# Altium schematic sheet Main.SchDoc: Main Schematic
size A3; SPICEModelCacheWFTKRAJF: <root> / <DocumentId>WFTKRAJF</DocumentId> / <CacheFrame Number="0"> / <Model Name="mc34063" Kind="ckt"> / <Text>.SUBCKT mc34063 csw esw ct comm fb vcc ipk cdr / * csw = switch BJT collector, esw = switch BJT emitter ct = timing capacitor, comm = common / * fb = feedback control, vcc = power in, ipk = peak limiting, cdr = driver BJT collector / * pin numbers match order of inputs above. / * Voltage Sources / Vlogic vp5v comm DC 5V / * Reference and feedback comparator / * The reference is at 1.25V but decreases linearly to zero for Vcc &lt; 3.75V / Breference ref comm V=(V(vcc,comm)-1.25)*u(V(vcc,comm)-1.25)-(V(vcc,comm)-2.5)*u(V(vcc,comm)-3.75) / B1 1 comm V=u(V(ref,fb)) / R6 1 cinvcontrol 10K / C6 cinvcontrol comm 10pF / * Oscillator / * Hysteresis switch to drive current into timing capacitor / R1 vp5v osc 10k / S1 osc comm ct comm swmod / .MODEL swmod SW (SW VT = 1 VH = 0.25) / * Current source to drive charge/discharge currents for the timing capacitor / Bcurrent ct comm I=-35uA+255uA*u(2.5-V(osc,comm)) / * Current limiting circuit increases the charge rate of the timing capacitor / Qlimit ct ipk vcc limitQ / .model limitQ PNP(IS=1E-12 VAF=100 BF=200 IKF=0.1 XTB=1.5 BR=4 / +  CJC=4.5E-12 CJE=10E-12 RB=20 RC=0.1 RE=0.1 TR=250E-9 TF=350E-12 ITF=1 VTF=2 XTF=3) / * Differentiator to provide delays to overcome latch race conditions / Ctrigger osc delay  1pF / Rtrigger delay comm 100K / * Delay pulse squaring comparators plus Delay gating logic. / * inverse of positive delay transition anded with the oscillator to delay the start of / * the next high part. This is then nanded with the feedback gating signal. / Bsetgate set comm V=(1-(1-u(V(delay,comm)-1))*u(V(osc,comm)-2.5)*u(V(cinvcontrol,comm)-0.5)) / * Reset is just the negative delay transition anded with the oscillator and inverted. / Bminus reset comm V=(1-u(V(delay,comm)+1)*(1-u(V(osc,comm)-2.5))) / * SR Latch / Blatch1 4 comm V=(1-V(reset,comm)*u(V(3,comm)-0.5)) / R4 4 2 10K / C4 2 comm 1pF IC=1V / Blatch2 gate comm V=(1-V(set,comm)*u(V(2,comm)-0.5)) / R5 gate 3 10K / C5 3 comm 1pF / * Output switch gating and drive / Bcurrentdrive currentdrive comm I=10mA-20mA*V(gate,comm)*u(V(cinvcontrol,comm)-0.5) / Qdrive cdr currentdrive swbase driverQ / .model driverQ NPN(Bf=300 CJC=4pF CJE=8pF RB=20 RC=0.1 RE=0.1) / D2 comm currentdrive 1N914 / D1 currentdrive vcc 1N914 / .MODEL 1N914 D(Is=2.52n Rs=0.568 N=1.752 Cjo=4p M=.4 Tt=20n) / Rde swbase esw 100 / Qswitch csw swbase esw switchQ / .MODEL switchQ npn (BF=75 RB=10 RE=0.25 RC=0.25 CJE=10pF CJC=10pF) / .ends</Text> / </Model> / </CacheFrame> / </root>; ApprovedBy: LD Stanton; CheckedBy: JC Pead; Author: LD Stanton; CompanyName: University of Cape Town; DrawnBy: Lawrence Stanton; Engineer: Lawrence Stanton; Organization: University of Cape Town; Address1: Department of Electrical Engineering; Address2: Rondebosch; Address3: Cape Town; Address4: South Africa 7701; DocumentNumber: 1; Revision: v1.0; SheetNumber: 1; SheetTotal: 1; Approv_Date_Eng: --/--/----; Approv_Date_Chk: --/--/----; PCB_Doc: PCB.PcbDoc; ASM_Doc: TBD; FAB_Doc: TBD; CML_Doc: TBD; BOM_Doc: TBD; Project_Name: USB Split Rail Power Supply
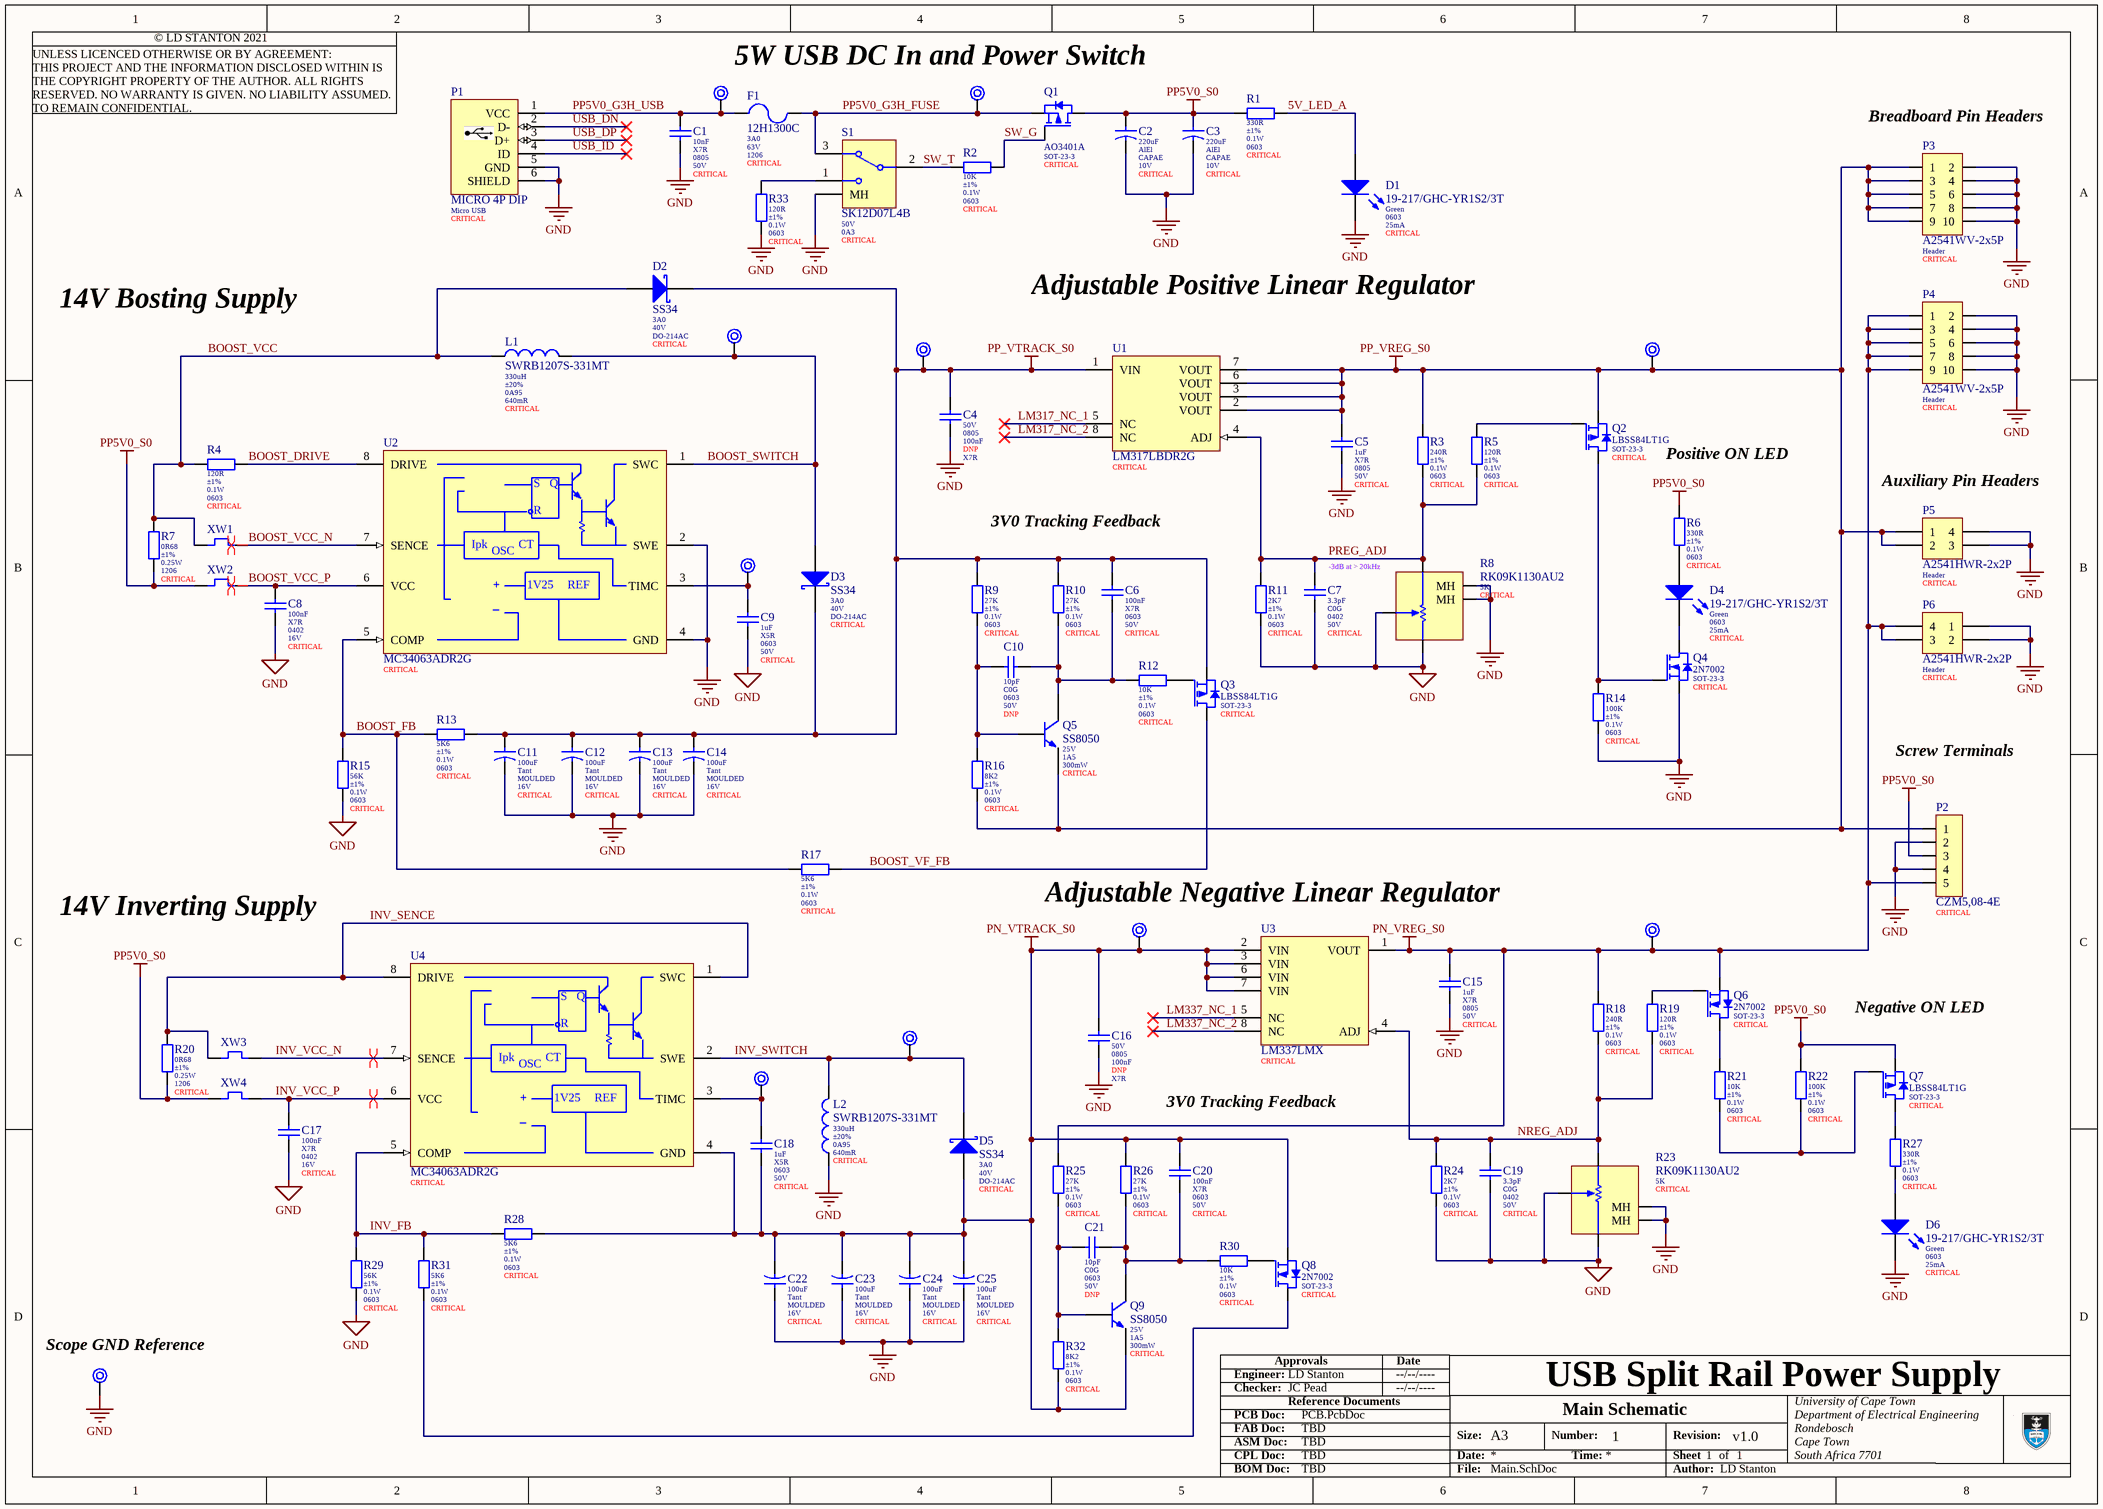
[diagram p0: Main.SchDoc]

## Parts
C1  value 10nF  Dielectric: X7R  Package: 0805  Voltage: 50V  Populate: CRITICAL  [0605_065_A_N]  (hidden comment: CL21B103KBANNNC)
C2  value 220uF  Dielectric: AlEl  Package: CAPAE  Voltage: 10V  Populate: CRITICAL  [CAPAE 6354]  (hidden comment: RVT1A221M0605)
C3  value 220uF  Dielectric: AlEl  Package: CAPAE  Voltage: 10V  Populate: CRITICAL  [CAPAE 6354]  (hidden comment: RVT1A221M0605)
C4  value 100nF  Voltage: 50V  Populate: DNP  Dielectric: X7R  [0805]  (hidden comment: CC0805KRX7R9BB104)
C5  value 1uF  Dielectric: X7R  Package: 0805  Voltage: 50V  Populate: CRITICAL  [0805_125_F_N]  (hidden comment: CL21B105KBFNNNE)
C6  value 100nF  Dielectric: X7R  Voltage: 50V  Populate: CRITICAL  [0603]  (hidden comment: CC0603KRX7R9BB104)
C7  value 3.3pF  Dielectric: C0G  Package: 0402  Voltage: 50V  Populate: CRITICAL  [0402_050]  (hidden comment: 0402CG3R3C500NT)
C8  value 100nF  Dielectric: X7R  Package: 0402  Voltage: 16V  Populate: CRITICAL  [0402_050_5_N]  (hidden comment: CL05B104KO5NNNC)
C9  value 1uF  Dielectric: X5R  Package: 0603  Voltage: 50V  Populate: CRITICAL  [0603_080_8_N]  (hidden comment: CL10A105KB8NNNC)
C10  value 10pF  Dielectric: C0G  Package: 0603  Voltage: 50V  Populate: DNP  [0603_080_8_N]  (hidden comment: CL10C100JB8NNNC)
C11  value 100uF  Dielectric: Tant  Package: MOULDED  Voltage: 16V  Populate: CRITICAL  [Case D]  (hidden comment: 293D107X9016D2TE3)
C12  value 100uF  Dielectric: Tant  Package: MOULDED  Voltage: 16V  Populate: CRITICAL  [Case D]  (hidden comment: 293D107X9016D2TE3)
C13  value 100uF  Dielectric: Tant  Package: MOULDED  Voltage: 16V  Populate: CRITICAL  [Case D]  (hidden comment: 293D107X9016D2TE3)
C14  value 100uF  Dielectric: Tant  Package: MOULDED  Voltage: 16V  Populate: CRITICAL  [Case D]  (hidden comment: 293D107X9016D2TE3)
C15  value 1uF  Dielectric: X7R  Package: 0805  Voltage: 50V  Populate: CRITICAL  [0805_125_F_N]  (hidden comment: CL21B105KBFNNNE)
C16  value 100nF  Voltage: 50V  Populate: DNP  Dielectric: X7R  [0805]  (hidden comment: CC0805KRX7R9BB104)
C17  value 100nF  Dielectric: X7R  Package: 0402  Voltage: 16V  Populate: CRITICAL  [0402_050_5_N]  (hidden comment: CL05B104KO5NNNC)
C18  value 1uF  Dielectric: X5R  Package: 0603  Voltage: 50V  Populate: CRITICAL  [0603_080_8_N]  (hidden comment: CL10A105KB8NNNC)
C19  value 3.3pF  Dielectric: C0G  Package: 0402  Voltage: 50V  Populate: CRITICAL  [0402_050]  (hidden comment: 0402CG3R3C500NT)
C20  value 100nF  Dielectric: X7R  Voltage: 50V  Populate: CRITICAL  [0603]  (hidden comment: CC0603KRX7R9BB104)
C21  value 10pF  Dielectric: C0G  Package: 0603  Voltage: 50V  Populate: DNP  [0603_080_8_N]  (hidden comment: CL10C100JB8NNNC)
C22  value 100uF  Dielectric: Tant  Package: MOULDED  Voltage: 16V  Populate: CRITICAL  [Case D]  (hidden comment: 293D107X9016D2TE3)
C23  value 100uF  Dielectric: Tant  Package: MOULDED  Voltage: 16V  Populate: CRITICAL  [Case D]  (hidden comment: 293D107X9016D2TE3)
C24  value 100uF  Dielectric: Tant  Package: MOULDED  Voltage: 16V  Populate: CRITICAL  [Case D]  (hidden comment: 293D107X9016D2TE3)
C25  value 100uF  Dielectric: Tant  Package: MOULDED  Voltage: 16V  Populate: CRITICAL  [Case D]  (hidden comment: 293D107X9016D2TE3)
D1  19-217/GHC-YR1S2/3T  Colour: Green  Package: 0603  Current: 25mA  Placement: CRITICAL  [LED 0603]
D2  SS34  DC Forward Curent: 3A0  DC Reverse Blocking: 40V  Placement: CRITICAL  [DO-214AC]
D3  SS34  DC Forward Curent: 3A0  DC Reverse Blocking: 40V  Placement: CRITICAL  [DO-214AC]
D4  19-217/GHC-YR1S2/3T  Colour: Green  Package: 0603  Current: 25mA  Placement: CRITICAL  [LED 0603]
D5  SS34  DC Forward Curent: 3A0  DC Reverse Blocking: 40V  Placement: CRITICAL  [DO-214AC]
D6  19-217/GHC-YR1S2/3T  Colour: Green  Package: 0603  Current: 25mA  Placement: CRITICAL  [LED 0603]
F1  12H1300C  Current: 3A0  Voltage: 63V  Package: 1206  Placement: CRITICAL  [1206_060]
L1  SWRB1207S-331MT  value 330uH  Tolerance: ±20%  Rated Current: 0A95  DC Resistance: 640mR  Populate: CRITICAL  [SWRB1207S]
L2  SWRB1207S-331MT  value 330uH  Tolerance: ±20%  Rated Current: 0A95  DC Resistance: 640mR  Populate: CRITICAL  [SWRB1207S]
P1  MICRO 4P DIP  USB Connector Type: Micro USB  Placement: CRITICAL  [MICRO 4P DIP]
P2  CZM5,08-4E  Placement: CRITICAL  [Screw Down 5]
P3  A2541WV-2x5P  Type: Header  Placement: CRITICAL  [Pin Header 10 2 Vertical Male]
P4  A2541WV-2x5P  Type: Header  Placement: CRITICAL  [Pin Header 10 2 Vertical Male]
P5  A2541HWR-2x2P  Type: Header  Placement: CRITICAL  [Pin Header 4 2 Right Female]
P6  A2541HWR-2x2P  Type: Header  Placement: CRITICAL  [Pin Header 4 2 Right Female]
Q1  AO3401A  Package: SOT-23-3  Placement: CRITICAL  [SOT-23-3 (2N7002)]
Q2  LBSS84LT1G  Package: SOT-23-3  Placement: CRITICAL  [SOT-23-3 (2N7002)]
Q3  LBSS84LT1G  Package: SOT-23-3  Placement: CRITICAL  [SOT-23-3 (2N7002)]
Q4  2N7002  Package: SOT-23-3  Placement: CRITICAL  [SOT-23-3 (2N7002)]
Q5  SS8050  VCE: 25V  Collector Current: 1A5  Power: 300mW  Placement: CRITICAL  [SOT-23-3 Generic]
Q6  2N7002  Package: SOT-23-3  Placement: CRITICAL  [SOT-23-3 (2N7002)]
Q7  LBSS84LT1G  Package: SOT-23-3  Placement: CRITICAL  [SOT-23-3 (2N7002)]
Q8  2N7002  Package: SOT-23-3  Placement: CRITICAL  [SOT-23-3 (2N7002)]
Q9  SS8050  VCE: 25V  Collector Current: 1A5  Power: 300mW  Placement: CRITICAL  [SOT-23-3 Generic]
R1  value 330R  Tolerance: ±1%  Power: 0.1W  Populate: CRITICAL  [0603]  (hidden comment: 0603WAF3300T5E)
R2  value 10K  Tolerance: ±1%  Power: 0.1W  Populate: CRITICAL  [0603]  (hidden comment: 0603WAF1002T5E)
R3  value 240R  Tolerance: ±1%  Power: 0.1W  Populate: CRITICAL  [0603]  (hidden comment: 0603WAF2400T5E)
R4  value 120R  Tolerance: ±1%  Power: 0.1W  Populate: CRITICAL  [0603]  (hidden comment: 0603WAF1200T5E)
R5  value 120R  Tolerance: ±1%  Power: 0.1W  Populate: CRITICAL  [0603]  (hidden comment: 0603WAF1200T5E)
R6  value 330R  Tolerance: ±1%  Power: 0.1W  Populate: CRITICAL  [0603]  (hidden comment: 0603WAF3300T5E)
R7  value 0R68  Tolerance: ±1%  Power: 0.25W  Populate: CRITICAL  [1206]  (hidden comment: 1206W4F680LT5E)
R8  RK09K1130AU2  Resistance: 5K  Placement: CRITICAL  [RK09K113]
R9  value 27K  Tolerance: ±1%  Power: 0.1W  Populate: CRITICAL  [0603]  (hidden comment: 0603WAF2702T5E)
R10  value 27K  Tolerance: ±1%  Power: 0.1W  Populate: CRITICAL  [0603]  (hidden comment: 0603WAF2702T5E)
R11  value 2K7  Tolerance: ±1%  Power: 0.1W  Populate: CRITICAL  [0603]  (hidden comment: 0603WAF2701T5E)
R12  value 10K  Tolerance: ±1%  Power: 0.1W  Populate: CRITICAL  [0603]  (hidden comment: 0603WAF1002T5E)
R13  value 5K6  Tolerance: ±1%  Power: 0.1W  Populate: CRITICAL  [0603]  (hidden comment: 0603WAF5601T5E)
R14  value 100K  Tolerance: ±1%  Power: 0.1W  Populate: CRITICAL  [0603]  (hidden comment: 0603WAF1003T5E)
R15  value 56K  Tolerance: ±1%  Power: 0.1W  Populate: CRITICAL  [0603]  (hidden comment: 0603WAF5602T5E)
R16  value 8K2  Tolerance: ±1%  Power: 0.1W  Populate: CRITICAL  [0603]  (hidden comment: 0603WAF8201T5E)
R17  value 5K6  Tolerance: ±1%  Power: 0.1W  Populate: CRITICAL  [0603]  (hidden comment: 0603WAF5601T5E)
R18  value 240R  Tolerance: ±1%  Power: 0.1W  Populate: CRITICAL  [0603]  (hidden comment: 0603WAF2400T5E)
R19  value 120R  Tolerance: ±1%  Power: 0.1W  Populate: CRITICAL  [0603]  (hidden comment: 0603WAF1200T5E)
R20  value 0R68  Tolerance: ±1%  Power: 0.25W  Populate: CRITICAL  [1206]  (hidden comment: 1206W4F680LT5E)
R21  value 10K  Tolerance: ±1%  Power: 0.1W  Populate: CRITICAL  [0603]  (hidden comment: 0603WAF1002T5E)
R22  value 100K  Tolerance: ±1%  Power: 0.1W  Populate: CRITICAL  [0603]  (hidden comment: 0603WAF1003T5E)
R23  RK09K1130AU2  Resistance: 5K  Placement: CRITICAL  [RK09K113]
R24  value 2K7  Tolerance: ±1%  Power: 0.1W  Populate: CRITICAL  [0603]  (hidden comment: 0603WAF2701T5E)
R25  value 27K  Tolerance: ±1%  Power: 0.1W  Populate: CRITICAL  [0603]  (hidden comment: 0603WAF2702T5E)
R26  value 27K  Tolerance: ±1%  Power: 0.1W  Populate: CRITICAL  [0603]  (hidden comment: 0603WAF2702T5E)
R27  value 330R  Tolerance: ±1%  Power: 0.1W  Populate: CRITICAL  [0603]  (hidden comment: 0603WAF3300T5E)
R28  value 5K6  Tolerance: ±1%  Power: 0.1W  Populate: CRITICAL  [0603]  (hidden comment: 0603WAF5601T5E)
R29  value 56K  Tolerance: ±1%  Power: 0.1W  Populate: CRITICAL  [0603]  (hidden comment: 0603WAF5602T5E)
R30  value 10K  Tolerance: ±1%  Power: 0.1W  Populate: CRITICAL  [0603]  (hidden comment: 0603WAF1002T5E)
R31  value 5K6  Tolerance: ±1%  Power: 0.1W  Populate: CRITICAL  [0603]  (hidden comment: 0603WAF5601T5E)
R32  value 8K2  Tolerance: ±1%  Power: 0.1W  Populate: CRITICAL  [0603]  (hidden comment: 0603WAF8201T5E)
R33  value 120R  Tolerance: ±1%  Power: 0.1W  Populate: CRITICAL  [0603]  (hidden comment: 0603WAF1200T5E)
S1  SK12D07L4B  Voltage: 50V  Current: 0A3  Placement: CRITICAL  [SK12D07L4B]
TP1  Test Point  [Test Point 0.6]  (value not drawn)  (no BOM)
TP2  Test Point  [Test Point 0.6]  (value not drawn)  (no BOM)
TP3  Test Point  [Test Point 0.6]  (value not drawn)  (no BOM)
TP4  Test Point  [Test Point 0.6]  (value not drawn)  (no BOM)
TP5  Test Point  [Test Point 0.6]  (value not drawn)  (no BOM)
TP6  Test Point  [Test Point 0.6]  (value not drawn)  (no BOM)
TP7  Test Point  [Test Point 0.6]  (value not drawn)  (no BOM)
TP8  Test Point  [Test Point 0.6]  (value not drawn)  (no BOM)
TP9  Test Point  [Test Point 0.6]  (value not drawn)  (no BOM)
TP10  Test Point  [Test Point 0.6]  (value not drawn)  (no BOM)
TP11  Test Point  [Test Point 0.8 TH]  (value not drawn)  (no BOM)
U1  LM317LBDR2G  Placement: CRITICAL  [SOIC-8 NB]
U2  MC34063ADR2G  Placement: CRITICAL  [SOIC-8 NB]
U3  LM337LMX  Placement: CRITICAL  [SOIC-8 D (R-PDSO-G8)]
U4  MC34063ADR2G  Placement: CRITICAL  [SOIC-8 NB]
XW1  Short 2 Nets  [Short 0.5mm 2 Net]  (value not drawn)  (net tie, no BOM)
XW2  Short 2 Nets  [Short 0.5mm 2 Net]  (value not drawn)  (net tie, no BOM)
XW3  Short 2 Nets  [Short 0.5mm 2 Net]  (value not drawn)  (net tie, no BOM)
XW4  Short 2 Nets  [Short 0.5mm 2 Net]  (value not drawn)  (net tie, no BOM)

## Nets
GND: C1.2 C2.2 C3.2 C4.2 C5.2 C7.2 C8.2 C9.2 C11.2 C12.2 C13.2 C14.2 C15.2 C16.2 C17.2 C19.2 C22.1 C23.1 C24.1 C25.1 D1.K D6.K L2.1 P1.5(GND) P1.6(SHIELD) P2.2 P2.4 P3.2 P3.4 P3.6 P3.8 P3.10 P4.2 P4.4 P4.6 P4.8 P4.10 P5.3 P5.4 P6.1 P6.2 Q4.2(S) R8.1 R8.2 R8.4(MH) R8.5(MH) R11.2 R14.1 R15.2 R23.2 R23.3 R23.4(MH) R23.5(MH) R24.2 R29.2 R33.1 S1.EH(MH) TP11.1 U2.2(SWE) U2.4(GND)
PN_VREG_S0: C15.1 P2.5 P4.1 P4.3 P4.5 P4.7 P4.9 P6.3 P6.4 Q6.2(S) R18.1 R25.1 TP8.1 U3.1(VOUT)
PN_VTRACK_S0: C16.1 C18.2 C20.1 C22.2 C23.2 C24.2 C25.2 D5.2(A) Q8.2(S) Q9.2(E) R26.1 R28.2 R32.2 TP7.1 U3.2(VIN) U3.3(VIN) U3.6(VIN) U3.7(VIN) U4.4(GND)
PP5V0_S0: C2.1 C3.1 P2.3 Q1.3(D) Q7.2(S) R1.1 R6.2 R7.2 R20.2 R22.2 XW2.2 XW4.2
PP_VREG_S0: C5.1 P2.1 P3.1 P3.3 P3.5 P3.7 P3.9 P5.1 P5.2 Q2.2(S) Q5.2(E) R3.1 R16.2 TP5.1 U1.2(VOUT) U1.3(VOUT) U1.6(VOUT) U1.7(VOUT)
PP_VTRACK_S0: C4.1 C6.1 C11.1 C12.1 C13.1 C14.1 D2.1(K) D3.1(K) Q3.2(S) R9.1 R10.1 R13.2 TP4.1 U1.1(VIN)
5V_LED_A: D1.A R1.2
BOOST_DRIVE: R4.2 U2.8(DRIVE)
BOOST_FB: R13.1 R15.1 R17.1 U2.5(COMP)
BOOST_SWITCH: D3.2(A) L1.2 TP3.1 U2.1(SWC)
BOOST_VCC: D2.2(A) L1.1 R4.1 R7.1 XW1.2
BOOST_VCC_N: U2.7(SENCE) XW1.1
BOOST_VCC_P: C8.1 U2.6(VCC) XW2.1
BOOST_VF_FB: Q3.3(D) R17.2
INV_FB: R28.1 R29.1 R31.2 U4.5(COMP)
INV_SENCE: R20.1 U4.1(SWC) U4.8(DRIVE) XW3.2
INV_SWITCH: D5.1(K) L2.2 TP9.1 U4.2(SWE)
INV_VCC_N: U4.7(SENCE) XW3.1
INV_VCC_P: C17.1 U4.6(VCC) XW4.1
LM317_NC_1: U1.5(NC)
LM317_NC_2: U1.8(NC)
LM337_NC_1: U3.5(NC)
LM337_NC_2: U3.8(NC)
NREG_ADJ: C19.1 R18.2 R19.1 R23.1 R24.1 U3.4(ADJ)
PP5V0_G3H_FUSE: F1.2 Q1.2(S) S1.3 TP2.1
PP5V0_G3H_USB: C1.1 F1.1 P1.1(VCC) TP1.1
PREG_ADJ: C7.1 R3.2 R5.1 R8.3 R11.1 U1.4(ADJ)
SW_G: Q1.1(G) R2.2
SW_T: R2.1 S1.2
USB_DN: P1.2(D-)
USB_DP: P1.3(D+)
USB_ID: P1.4(ID)
NetC6_2: C6.2 C10.2 Q5.3(C) R10.2 R12.1
NetC9_1: C9.1 TP6.1 U2.3(TIMC)
NetC10_1: C10.1 Q5.1(B) R9.2 R16.1
NetC18_1: C18.1 TP10.1 U4.3(TIMC)
NetC20_2: C20.2 C21.2 Q9.3(C) R26.2 R30.1
NetC21_1: C21.1 Q9.1(B) R25.2 R32.1
NetD4_A: D4.A R6.1
NetD4_K: D4.K Q4.3(D)
NetD6_A: D6.A R27.2
NetQ2_1: Q2.1(G) R5.2
NetQ2_3: Q2.3(D) Q4.1(G) R14.2
NetQ3_1: Q3.1(G) R12.2
NetQ6_1: Q6.1(G) R19.2
NetQ6_3: Q6.3(D) R21.1
NetQ7_1: Q7.1(G) R21.2 R22.1
NetQ7_3: Q7.3(D) R27.1
NetQ8_1: Q8.1(G) R30.2
NetQ8_3: Q8.3(D) R31.1
NetR33_2: R33.2 S1.1

## Layout directives
differential pair: BOOST_VCC_N, BOOST_VCC_P, INV_VCC_N, INV_VCC_P

## Notes on the sheet
- 5W USB DC In and Power Switch
- (near P3) Breadboard Pin Headers
- 14V Bosting Supply
- Adjustable Positive Linear Regulator
- Positive ON LED
- (near P5) Auxiliary Pin Headers
- 3V0 Tracking Feedback
- -3dB at > 20kHz
- Screw Terminals
- 14V Inverting Supply
- Adjustable Negative Linear Regulator
- Negative ON LED
- (near TP11) Scope GND Reference
- © LD STANTON 2021
- UNLESS LICENCED OTHERWISE OR BY AGREEMENT:
  THIS PROJECT AND THE INFORMATION DISCLOSED WITHIN IS THE COPYRIGHT PROPERTY OF THE AUTHOR. ALL RIGHTS RESERVED. NO WARRANTY IS GIVEN. NO LIABILITY ASSUMED. TO REMAIN CONFIDENTIAL.
- Engineer:
- Checker:
- Approvals
- Date
- PCB Doc:
- ASM Doc:
- FAB Doc:
- CPL Doc:
- Reference Documents
- Size:
- Date:
- A3
- Number:
- Time:
- Revision:
- Sheet
- of
- BOM Doc:
- File:
- Author:
- (in symbol MC34063ADR2G) S; Q; R; Ipk; CT; OSC; +; 1V25; REF; _

## Library data of the parts
C1 = MLCC 10nF 0805 50V X7R: MLCC 10nF 0805 50V X7R ±10%; Tolerance: ±10%; LCSC Part Number: C1710; ComponentLink1Description: Datasheet; ComponentLink1URL: https://datasheet.lcsc.com/szlcsc/Samsung-Electro-Mechanics-CL05C100JB5NNNC_C32949.pdf; Supplier 1: Digi-Key; Supplier Part Number 1: 1276-1015-1-ND
C2 C3 = Cap AlEl 220uF 10V: Aluminium Electrolytic Capacitor 220uF CAPAE 10V ±20%; Manufacturer: Honor Elec; Tolerance: ±20%; LCSC Part Number: C3345; ComponentLink1Description: Datasheet; ComponentLink1URL: https://datasheet.lcsc.com/szlcsc/Samsung-Electro-Mechanics-CL05C100JB5NNNC_C32949.pdf
C4 C16 = MLCC 100nF 50V 0805 X7R: MLCC 100nF 50V 0805 X7R ±10%; Tolerance: ±10%; LCSC Part Number: C49678; ComponentLink1Description: Datasheet; ComponentLink1URL: https://datasheet.lcsc.com/szlcsc/YAGEO-CC0603KRX7R9BB104_C14663.pdf; Package: 0805
C5 C15 = MLCC 1uF 0805 50V X7R: MLCC 1uF 0805 50V X7R ±10%; Tolerance: ±10%; LCSC Part Number: C15849; ComponentLink1Description: Datasheet; ComponentLink1URL: https://datasheet.lcsc.com/szlcsc/Samsung-Electro-Mechanics-CL05C100JB5NNNC_C32949.pdf; Supplier 1: Digi-Key; Supplier 2: Digi-Key; Supplier Part Number 2: 1276-1026-1-ND; Supplier Part Number 1: 1276-1029-1-ND
C6 C20 = MLCC 100nF 50V 0603 X7R: MLCC 100nF 50V 0603 X7R ±10%; Tolerance: ±10%; LCSC Part Number: C14663; ComponentLink1Description: Datasheet; ComponentLink1URL: https://datasheet.lcsc.com/szlcsc/YAGEO-CC0603KRX7R9BB104_C14663.pdf; Supplier 1: Digi-Key; Supplier Part Number 1: 311-1344-6-ND; Package: 0603
C7 C19 = MLCC 3.3pF 0402 50V C0G: MLCC 3.3pF 0402 50V C0G ±0.25pF; Tolerance: ±0.25pF; LCSC Part Number: C1565; ComponentLink1Description: Datasheet; ComponentLink1URL: https://datasheet.lcsc.com/szlcsc/Guangdong-Fenghua-Advanced-Tech-0402B102K500NT_C1523.pdf
C8 C17 = MLCC 100nF 0402 16V X7R: MLCC 100nF 0402 16V X7R ±10%; Tolerance: ±10%; LCSC Part Number: C1525; ComponentLink1Description: Datasheet; ComponentLink1URL: https://datasheet.lcsc.com/szlcsc/Samsung-Electro-Mechanics-CL05C100JB5NNNC_C32949.pdf
C9 C18 = MLCC 1uF 0603 50V X5R: MLCC 1uF 0603 50V X5R ±10%; Tolerance: ±10%; LCSC Part Number: C15849; ComponentLink1Description: Datasheet; ComponentLink1URL: https://datasheet.lcsc.com/szlcsc/Samsung-Electro-Mechanics-CL05C100JB5NNNC_C32949.pdf; Supplier 1: Digi-Key; Supplier Part Number 1: 1276-1860-1-ND
C10 C21 = MLCC 10pF 0603 50V C0G: MLCC 10pF 0603 C0G ±0.1pF; Tolerance: ±0.1pF; LCSC Part Number: C1634; ComponentLink1Description: Datasheet; ComponentLink1URL: https://datasheet.lcsc.com/szlcsc/Samsung-Electro-Mechanics-CL05C100JB5NNNC_C32949.pdf; Supplier 1: Digi-Key; Supplier Part Number 1: 1276-1027-1-ND
C11-C14 C22-C25 = Cap Tant 100uF 16V: Tantalum Capacitor 100uF 16V ±20%; Manufacturer: Vishay; Tolerance: ±20%; LCSC Part Number: C129696; ComponentLink1Description: Datasheet; ComponentLink1URL: https://datasheet.lcsc.com/szlcsc/Vishay-Intertech-293D107X9016D2TE3_C129696.pdf
D1 D4 D6 = LED 0603 Green: LED 0603 SMT Green; Nominal Forward Voltage: 3V3; LCSC Part Number: C72043; Supplier 1: Mouser; Supplier Part Number 1: 638-19217GHCYR1S23T; ComponentLink1Description: Datasheet; ComponentLink1URL: https://datasheet.lcsc.com/szlcsc/Everlight-Elec-19-217-GHC-YR1S2-3T_C72043.pdf
D2 D3 D5 = SS34: Schottky Barrier Diode 40V 3A0 550mV; Manufacturer: MDD; LCSC Part Number: C8678; ComponentLink1Description: Datasheet; ComponentLink1URL: https://datasheet.lcsc.com/szlcsc/1903051003_MDD-Jiangsu-Yutai-Elec-SS34_C8678.pdf; Package: DO-214AC
F1 = Fuse 3A Slow 1206: Fuse SMD Slow Blow 3A 63VAC 1206; ComponentLink1Description: Datasheet; Type: Slow Blow; LCSC Part Number: C182445
L1 L2 = Inductor 330uH ±20% 0A95: Inductor 330uH ±20% 0A95 640mR Moulded SMD 12.5x12.5x8.0mm; Manufacturer: Sunlord; ComponentLink1Description: Datasheet; ComponentLink1URL: https://datasheet.lcsc.com/szlcsc/1912111437_Sunlord-MWSA0603S-220MT_C408453.pdf; Saturation Current: 0A95; LCSC Part Number: C169381
P1 = MICRO 4P DIP: Micro USB Connector SMT with TH Mounts; LCSC Part Number: C456008
P2 = Screw Down 5 Way 5.08mm: Screw Down Terminal 5 Way 5.08mm Pitch
P3 P4 = Pin Header 10 2 Male Vertical: Pin Header 10 Way Double Row Vertical Angle; ComponentLink1Description: Datasheet; ComponentLink1URL: https://datasheet.lcsc.com/szlcsc/2010160505_CJT-Changjiang-Connectors-A2541WV-2x5P_C225520.pdf; LCSC Part Number: C225520
P5 P6 = Pin Header 4 2 Female Right: Pin Header 4 Way Double Row Female Right Angle
Q1 = AO3401A: MOSFET Trench 4A0 30V 85mR ±12V P-Channel Enhancement AOS SOT-22-3L; VGS(th) Max: -1v3; Power: 0.9W; Id Max: 3A2; VDS Max: -30V; ComponentLink2URL: https://datasheet.lcsc.com/szlcsc/Alpha-Omega-Semicon-AOS-AO3401A_C15127.pdf; VGS Max: ±12V; ComponentLink2Description: Datasheet; Rds Max: 85mR; LCSC Part Number: C20917
Q2 Q3 Q7 = LBSS84LT1G: Small Signal MOSFET, 130 mA, 50 V, P-Channel, Enhancement, LRC SOT-23-3; Ciss Typ: 30pF; VGS(th) Max: 2V0; Crss Typ: 5pF; VGS Max: ±20V; Power: 0.225W; Coss Typ: 10pF; Id Max: 0.13A; Rds Max: 10R; VDS Max: -50V; ComponentLink2URL: https://datasheet.lcsc.com/szlcsc/Leshan-Radio-LBSS84LT1G_C8492.pdf; ComponentLink2Description: Datasheet; LCSC Part Number: C8492
Q4 Q6 Q8 = 2N7002: Small Signal MOSFET, 500 mA, 60 V, N-Channel, Enhancement, JCET SOT-23-3; Ciss Typ: 50pF; VGS(th) Max: 2V5; Crss Typ: 5pF; VGS Max: ±20V; Power: 0.225W; Coss Typ: 25pF; Id Max: 0.2A; Rds Max: 7R; ComponentLink2URL: https://datasheet.lcsc.com/szlcsc/Changjiang-Electronics-Tech-CJ-2N7002_C8545.pdf; ComponentLink2Description: Datasheet; LCSC Part Number: C8545
Q5 Q9 = SS8050: BJT NPN 1A5 25V SOT-23-3; Manufacturer: Changjiang Electronics; DC Gain: 120-400; VCE(sat): 0V5; LCSC Part Number: C2150; ComponentLink1Description: Datasheet; ComponentLink1URL: https://datasheet.lcsc.com/szlcsc/Changjiang-Electronics-Tech-CJ-SS8050_C2150.pdf
R1 R6 R27 = Res 330R 0603: Lead Free Thick Film Chip Resistor 0805 ±1%; ComponentLink1Description: Datasheet; ComponentLink1URL: https://datasheet.lcsc.com/szlcsc/1811062009_UNI-ROYAL-Uniroyal-Elec-0603WAF1002T5E_C25804.pdf; Temperature: -55 ~ 155°C; LCSC Part Number: C23138; Package: 0603
R2 R12 R21 R30 = Res 10K 0603: Lead Free Thick Film Chip Resistor 0603 ±1%; ComponentLink1Description: Datasheet; ComponentLink1URL: https://datasheet.lcsc.com/szlcsc/1811062009_UNI-ROYAL-Uniroyal-Elec-0603WAF1002T5E_C25804.pdf; Temperature: -55 ~ 155°C; LCSC Part Number: C25804; Package: 0603
R3 R18 = Res 240R 0603: Lead Free Thick Film Chip Resistor 0603 ±1%; ComponentLink1Description: Datasheet; ComponentLink1URL: https://datasheet.lcsc.com/szlcsc/1811062009_UNI-ROYAL-Uniroyal-Elec-0603WAF1002T5E_C25804.pdf; Temperature: -55 ~ 155°C; LCSC Part Number: C23350; Package: 0603
R4 R5 R19 R33 = Res 120R 0603: Lead Free Thick Film Chip Resistor 0603 ±1%; ComponentLink1Description: Datasheet; ComponentLink1URL: https://datasheet.lcsc.com/szlcsc/1811062009_UNI-ROYAL-Uniroyal-Elec-0603WAF1002T5E_C25804.pdf; Temperature: -55 ~ 155°C; LCSC Part Number: C22787; Package: 0603
R7 R20 = Res 0R68 1206: Lead Free Thick Film Chip Resistor 1206 ±1%; ComponentLink1Description: Datasheet; ComponentLink1URL: https://datasheet.lcsc.com/szlcsc/1811062009_UNI-ROYAL-Uniroyal-Elec-0603WAF1002T5E_C25804.pdf; Temperature: -55 ~ 155°C; LCSC Part Number: C19108; Package: 1206
R8 R23 = Pot 5K THT 9.8mm: 5K Potentiometer THT 9.8mm Diameter ±20% 20VDC; Manufacturer: Alpsalpine; LCSC Part Number: C388855
R9 R10 R25 R26 = Res 27K 0603: Lead Free Thick Film Chip Resistor 0603 ±1%; ComponentLink1Description: Datasheet; ComponentLink1URL: https://datasheet.lcsc.com/szlcsc/1811062009_UNI-ROYAL-Uniroyal-Elec-0603WAF1002T5E_C25804.pdf; Temperature: -55 ~ 155°C; LCSC Part Number: C22967; Package: 0603
R11 R24 = Res 2K7 0603: Lead Free Thick Film Chip Resistor 0603 ±1%; ComponentLink1Description: Datasheet; ComponentLink1URL: https://datasheet.lcsc.com/szlcsc/1811062009_UNI-ROYAL-Uniroyal-Elec-0603WAF1002T5E_C25804.pdf; Temperature: -55 ~ 155°C; LCSC Part Number: C13167; Package: 0603
R13 R17 R28 R31 = Res 5K6 0603: Lead Free Thick Film Chip Resistor 0603 ±1%; ComponentLink1Description: Datasheet; ComponentLink1URL: https://datasheet.lcsc.com/szlcsc/1811062009_UNI-ROYAL-Uniroyal-Elec-0603WAF1002T5E_C25804.pdf; Temperature: -55 ~ 155°C; LCSC Part Number: C23189; Package: 0603
R14 R22 = Res 100K 0603: Lead Free Thick Film Chip Resistor 0603 ±1%; ComponentLink1Description: Datasheet; ComponentLink1URL: https://datasheet.lcsc.com/szlcsc/1811062009_UNI-ROYAL-Uniroyal-Elec-0603WAF1002T5E_C25804.pdf; Temperature: -55 ~ 155°C; LCSC Part Number: C25803; Package: 0603
R15 R29 = Res 56K 0603: Lead Free Thick Film Chip Resistor 0603 ±1%; ComponentLink1Description: Datasheet; ComponentLink1URL: https://datasheet.lcsc.com/szlcsc/1811062009_UNI-ROYAL-Uniroyal-Elec-0603WAF1002T5E_C25804.pdf; Temperature: -55 ~ 155°C; LCSC Part Number: C23206; Package: 0603
R16 R32 = Res 8K2 0603: Lead Free Thick Film Chip Resistor 0603 ±1%; ComponentLink1Description: Datasheet; ComponentLink1URL: https://datasheet.lcsc.com/szlcsc/1811062009_UNI-ROYAL-Uniroyal-Elec-0603WAF1002T5E_C25804.pdf; Temperature: -55 ~ 155°C; LCSC Part Number: C25981; Package: 0603
S1 = SW Toggle Slide Right Angle 0A3 50V: Switch Toggle Slider THT Right Angle 0A3 50V; LCSC Part Number: C480340
TP1-TP11 = Test Point: Test Point. Multiple pad options.
U1 = LM317LBDR2G: 100mA, 1V2 - 37V Adjustable Output, Positive Voltage Regulator; Manufacturer: ON Semiconductor; LCSC Part Number: C274645; ComponentLink1Description: Datasheet; ComponentLink1URL: https://datasheet.lcsc.com/szlcsc/ON-Semicon-ON-LM317LBDR2G_C274645.pdf; Supplier 1: Newark; Supplier Part Number 1: 81Y6438
U2 U4 = MC34063ADR2G: 1A5 Step-Up, Step-Down, Inverting Switching Reulator; Manufacturer: ON Semi; LCSC Part Number: C32078; Supplier 1: Digi-Key; Supplier Part Number 1: MC34063ADR2GOSCT-ND; ComponentLink1Description: Datasheet; ComponentLink1URL: https://www.onsemi.com/pdf/datasheet/mc34063a-d.pdf; ComponentLink2Description: Application Note; ComponentLink2URL: https://www.onsemi.com/pub/Collateral/AN920-D.PDF
U3 = LM337LMX: 100mA, -1V2 to -37V Adjustable Negative Voltage Regulator; Manufacturer: Texas Instruments; LCSC Part Number: C7947; Supplier 1: Digi-Key; Supplier Part Number 1: LM337LMXCT-ND; ComponentLink1Description: Datasheet; ComponentLink1URL: https://www.ti.com/lit/ds/symlink/lm337l.pdf?ts=1616125755321&ref_url=https%253A%252F%252Fwww.google.ru%252F
XW1-XW4 = Short 2 Nets: Net Tie 2 Nets; Value: 0